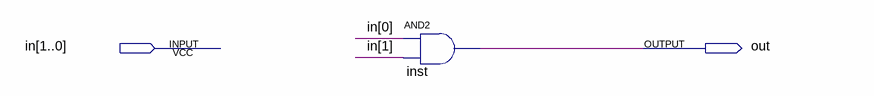
[diagram p0: schematic sheet]
// Quartus schematic and_ex.bdf as structural Verilog: 1 symbols, 2 pins
module and_ex (
  input  [1:0] in,
  output out
);

  and inst (out, in[0], in[1]);
endmodule
